# EAGLE design Battery_Buttons_V2 (EAGLE 7.6.0)
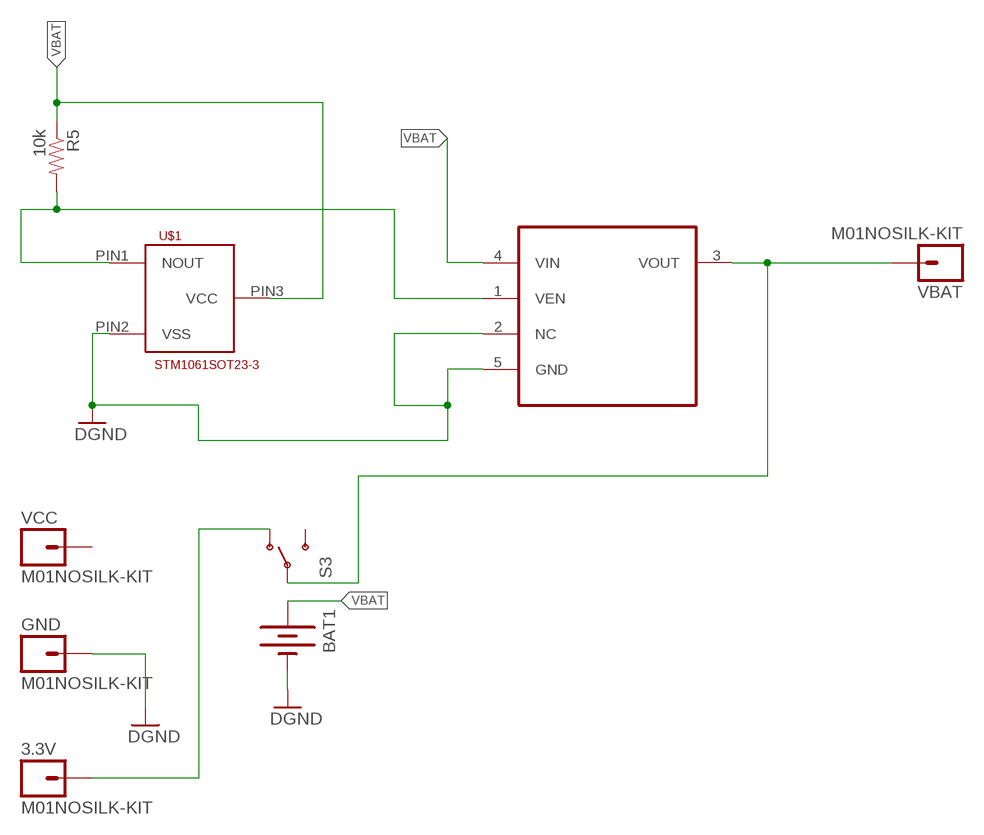
[diagram p0: schematic, sheet 1]

## Parts
3.3V  M01NOSILK-KIT  [1X01NS-KIT]
BAT1  BATTERY245PTH  [BATTCON_245MM_PTH]
GND  M01NOSILK-KIT  [1X01NS-KIT]
R5  10k  RESISTOR0603-RES  [0603-RES]
S3  SWITCH-SPDT-SMD-A  [SWITCH-SPST-SMD-A]
U4  LP38693MP-3.3  [SOT150P696X180-5N]
U$1  STM1061SOT23-3  [STM1061]
VBAT  M01NOSILK-KIT  [1X01NS-KIT]
VCC  M01NOSILK-KIT  [1X01NS-KIT]

## Nets
DGND: BAT1.GND(-)
GND: GND.1 U4.2(NC) U4.5(GND) U$1.PIN2(VSS) ; supply symbol labelled DGND
N$1: S3.2(P) U4.3(VOUT) VBAT.1
N$4: R5.2 U4.1(VEN) U$1.PIN1(NOUT)
N$5: 3.3V.1 S3.1(O)
N$10: U4.4(VIN)
N$11: R5.1 U$1.PIN3(VCC)
VBAT: BAT1.POS1(+) BAT1.POS2(+)
Unconnected: S3.3(S) VCC.1

## Library data of the parts
3.3V GND VBAT VCC = SparkFun-Connectors:M01: Header 1 Standard 1-pin 0.1" header. Use with straight break away headers (SKU : PRT-00116), right angle break away headers (PRT-00553), swiss pins (PRT-00743), machine pins (PRT-00117), and female headers (PRT-00115).; OC_FARNELL: unknown
BAT1 = STM1061:BATTERY: Battery Holders Various common sizes : AA, AAA, 20mm coin cell and 12mm coin cell. 20MM_4LEGS, BATT-10373; OC_FARNELL: unknown
R5 = SparkFun-Passives:RESISTOR: Resistor Basic schematic elements and footprints for 0603, 1206, and PTH resistors.
S3 = SparkFun-Electromechanical:SWITCH-SPDT: SPDT Switch Simple slide switch, Spark Fun Electronics SKU : COM-00102 DPDT SMT slide switch, AYZ0202, SWCH-08179; OC_FARNELL: unknown
U4 = LP3869Regulator:LP38693MP-3.3: Linear Regulators; MPN: LP38693MP-3.3; OC_FARNELL: 1008061; OC_NEWARK: 41K7496; PACKAGE: SOT-223-5; SUPPLIER: National
U$1 = STM1061:STM1061: STM1061 SOT-23-3 Package Low Power Voltage Detector

## Board
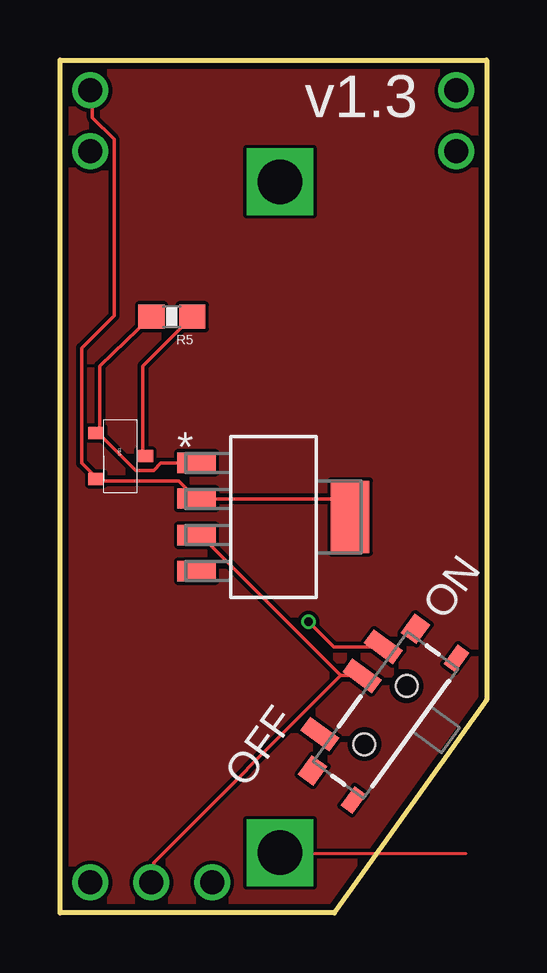
[diagram p1: board, top side]
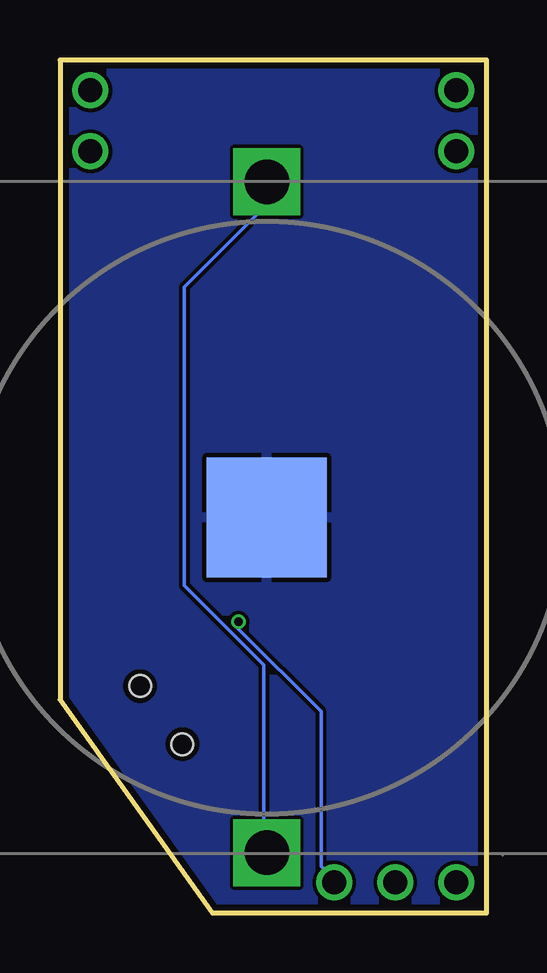
[diagram p2: board, bottom side, seen from below]

Size 17.78 x 35.56 mm. Coordinates in mm from the lower left corner, seen from the top.
Outline: 17.78,35.56 17.78,8.89 11.43,0 0,0 0,35.56 17.78,35.56
Copper layers (1*16): Top 0.018mm / dielectric 1.55mm / Bottom 0.018mm
Design rules "eC_2Layer_PClass6_BaseCopperO18_eCDefault": minimum track width 0.15mm, minimum drill 0.35mm, track to track 0.15mm, track to pad 0.15mm, pad to pad 0.15mm, via to via 0.15mm, smd to smd 0mil, copper to edge 0.25mm, drill to drill 0.35mm, minimum pad ring 0.175mm, minimum via ring 0.125mm, stop-mask expansion 0mil, vias tented up to drill 0.45mm, thermal gap 0.2mm

### Footprints (pad centres in the part's own frame; a part is rotated, then mirrored left to right if it is on the bottom)
1X01NS-KIT = drill 1: 1 0,0
BATTCON_245MM_PTH = smd 5 x 5: GND 0,0 | drill 1.854 square: POS1 -14,0; POS2 13.97,0
0603-RES = smd 1.1 x 1: 1 -0.85,0; 2 0.85,0
SWITCH-SPST-SMD-A = smd 0.7 x 1.5: 1 -2.25,-1.75; 2 -0.75,-1.75; 3 2.25,-1.75 | smd 1 x 0.6: GND1 -3.65,1; GND3 3.65,1 | smd 1 x 0.8: GND2 -3.65,-1.1; GND4 3.65,-1.1 | hole 0.9: -1.5,0; 1.5,0
SOT150P696X180-5N = smd 1.6 x 0.838: 1 -3.2,2.261; 2 -3.2,0.762; 3 -3.2,-0.762; 4 -3.2,-2.261 | smd 1.6 x 2.997: 5 3.2,0
STM1061 = smd 0.65 x 0.5: PIN1 -1.036,0.95; PIN2 -1.037,-0.957; PIN3 1.011,-0.003

### Placement (x,y rotation side)
3.3V  6.35,1.27 0 top
BAT1  9.16,16.48 270 bottom
GND  1.27,34.29 0 top
R5  4.66,24.86 180 top
S3  13.56,8.25 234 top
U4  8.89,16.51 0 top
U$1  2.54,19.05 0 top
VBAT  3.81,1.27 0 top
VCC  16.51,34.29 0 top

### Tracks (layer width: path | path; a pad name or v marks a point on that pad's centre or on a via)
DGND
  pour Top: 0,0 0,35.56 17.78,35.56 17.78,8.89 11.43,0
  pour Bottom: 0,0 0,35.56 17.78,35.56 17.78,8.89 11.43,0
GND
  Top 0.15: U4.5 12,16.65 11.4,17.25 5.7,17.25 U4.2 5.55,17.4 4.95,18 1.65,18 U$1.PIN2 1.5,18.15 0.9,18.75 0.9,23.55 2.25,24.9 2.25,32.25 1.35,33.15 1.35,34.2 GND.1
N$1
  Top 0.15: 11.7,9.9 12.45,9.9 S3.2 | 11.7,9.9 6,15.6 5.7,15.6 U4.3 | 11.7,9.9 3.9,2.1 3.9,1.35 VBAT.1
N$3  (via drill 1)
  other vias: 1.27,31.75
N$4
  Top 0.15: R5.2 1.65,22.8 1.65,20.1 U$1.PIN1 1.65,19.95 3.15,18.45 3.9,18.45 4.2,18.75 5.55,18.75 U4.1
N$5  (via drill 0.35)
  Top 0.15: v10.35,12.15 11.4,11.1 13.35,11.1 S3.1
  Bottom 0.15: v10.35,12.15 10.35,11.85 6.9,8.4 6.9,1.95 6.3,1.35 3.3V.1
N$8  (via drill 1)
  other vias: 1.27,1.27
N$9  (via drill 1)
  other vias: 16.51,31.75
N$11
  Top 0.15: U$1.PIN3 3.45,19.05 3.45,22.8 R5.1
VBAT
  Bottom 0.15: BAT1.POS2 9.3,2.55 9.3,10.35 12.6,13.65 12.6,26.1 9.3,29.4 9.3,30.45 BAT1.POS1

### Text on the board
tPlace: v1.3 | ON | OFF